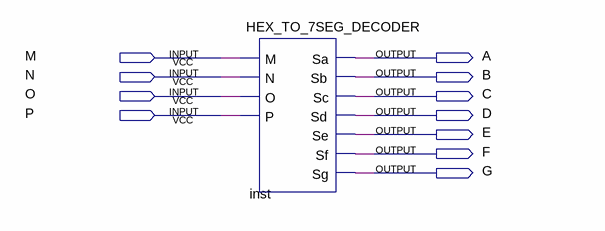
[diagram p0: schematic sheet]
// Quartus schematic tmp.bdf as structural Verilog: 1 symbols, 11 pins
module tmp (
  input  M,
  input  N,
  input  O,
  input  P,
  output A,
  output B,
  output C,
  output D,
  output E,
  output F,
  output G
);

  HEX_TO_7SEG_DECODER inst (.M(M), .N(N), .O(O), .P(P), .Sa(A), .Sb(B), .Sc(C), .Sd(D), .Se(E), .Sf(F), .Sg(G));
endmodule
